# Altium project HIVE_SIGHT.PrjPcb (part 2 of 4)

## Sheet HIVE_SIGHT_DECAWAVE_A.SchDoc
size Tabloid; SheetNumber: 4; SheetTotal: 6; Sheet_Name: DECAWAVE; Size: 11x17
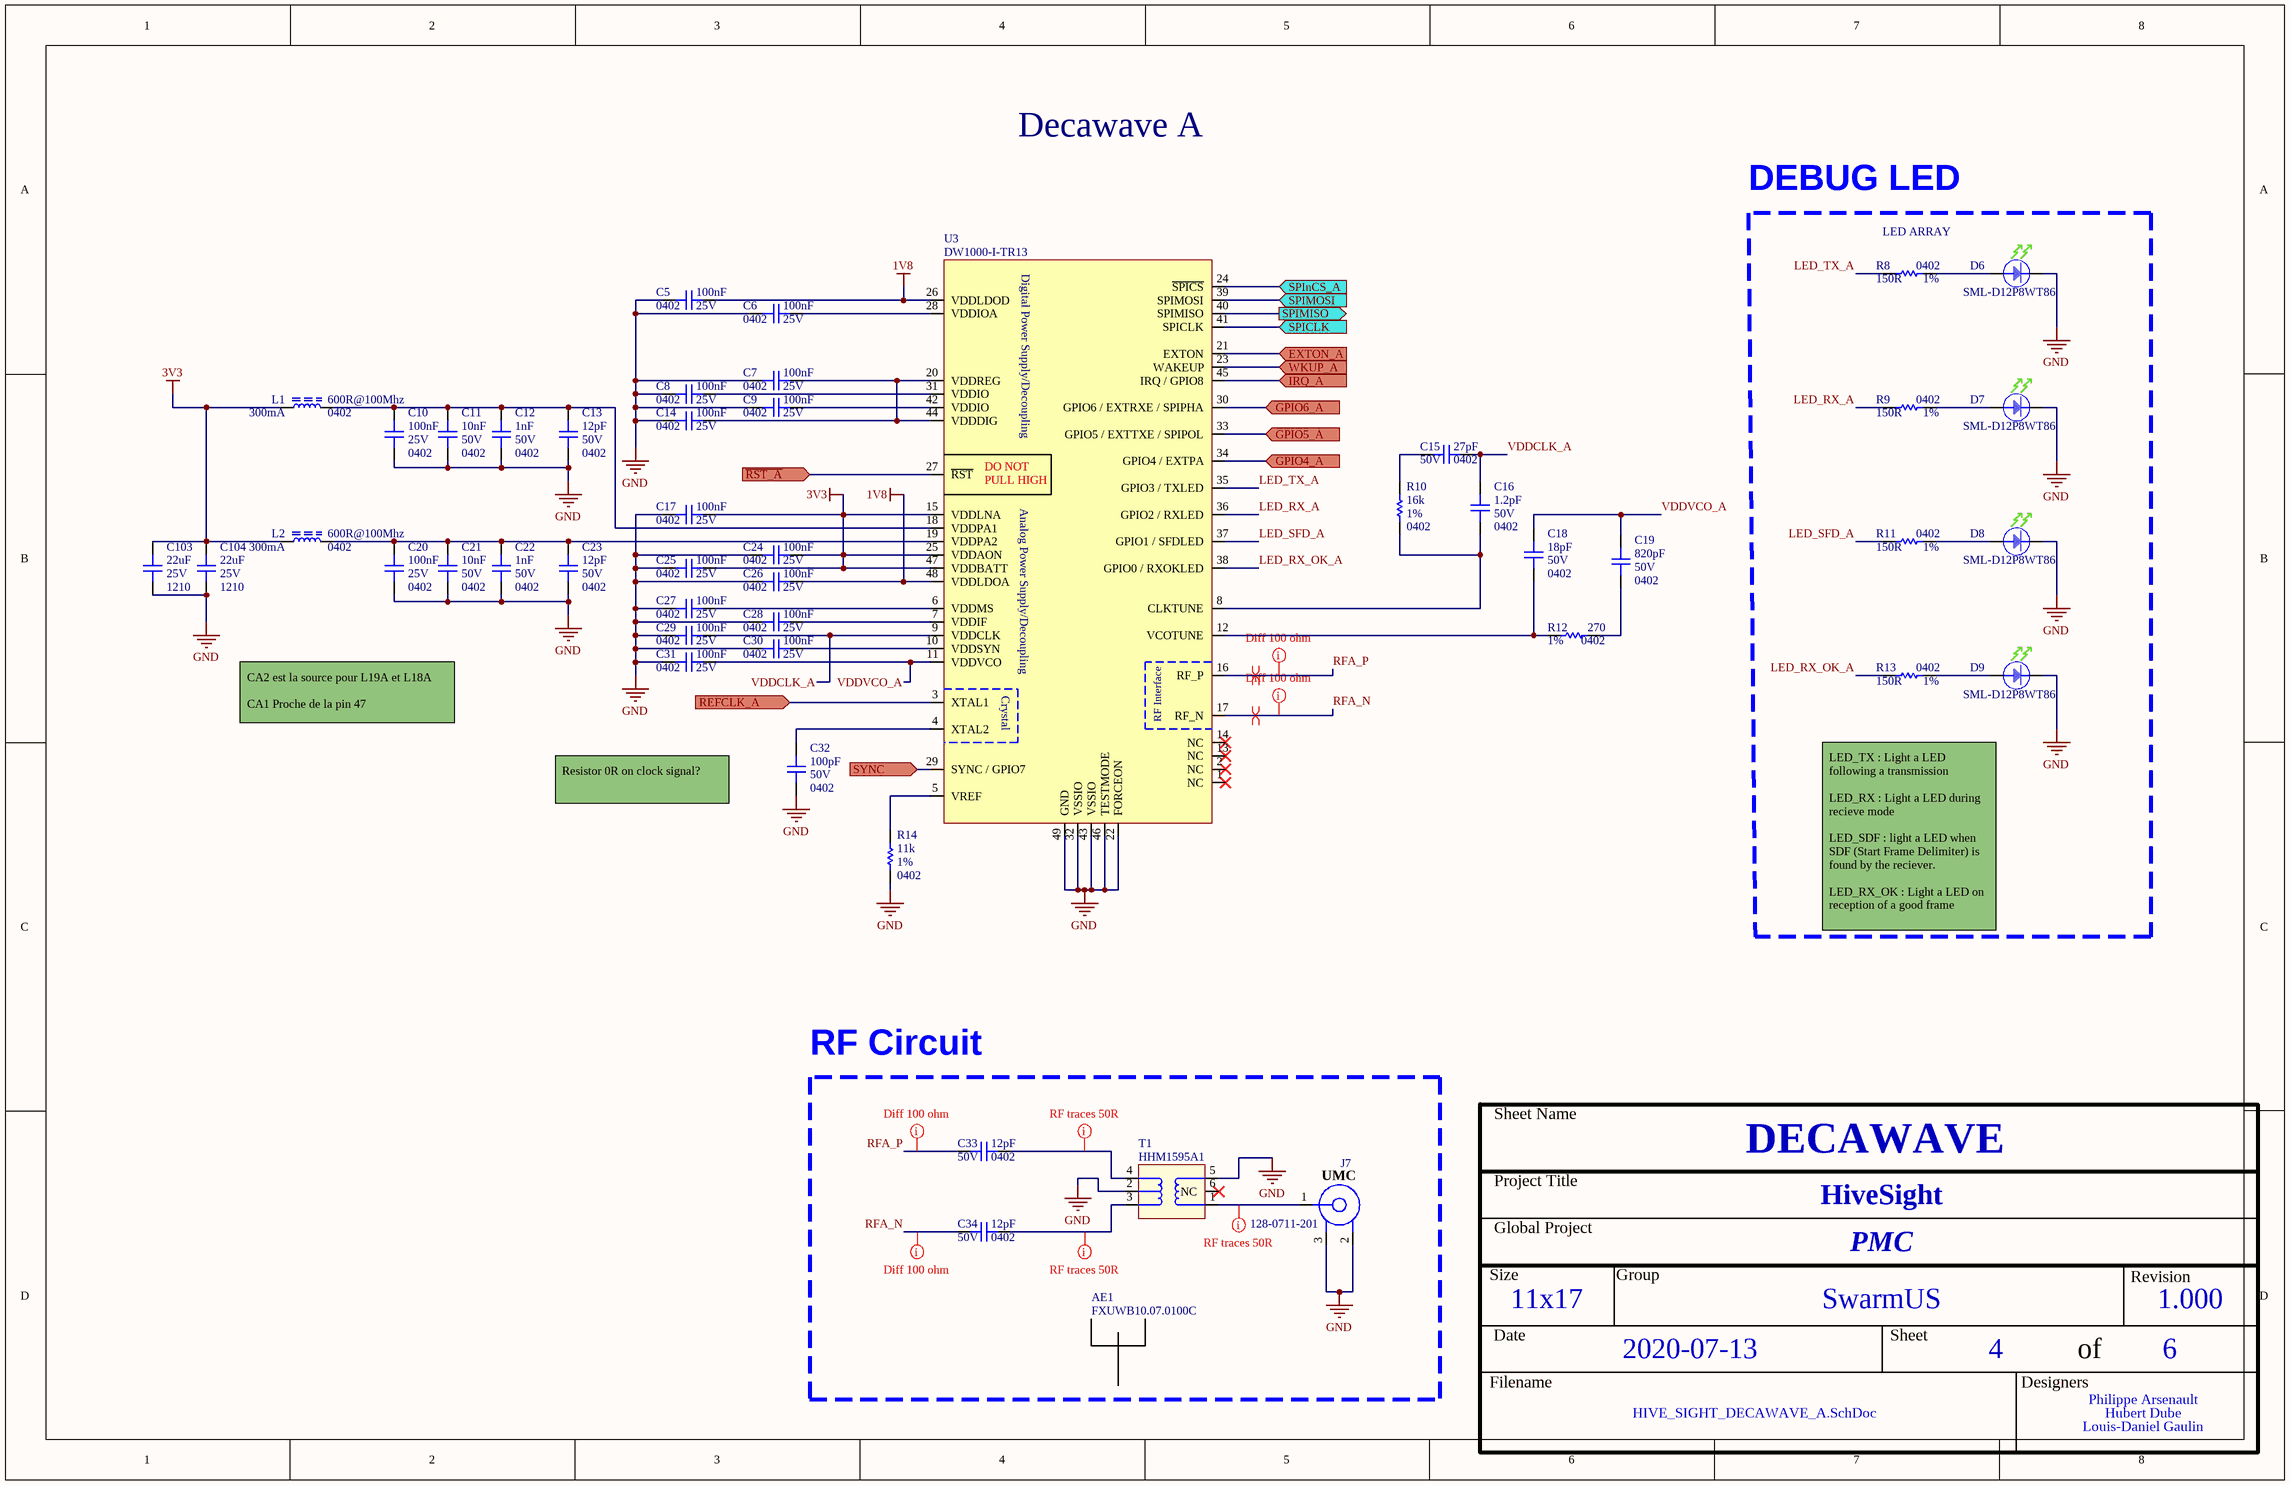
[diagram p4: HIVE_SIGHT_DECAWAVE_A.SchDoc]

### Parts
AE1  FXUWB10.07.0100C  (mechanical)
C5  value 100nF  Package: 0402  Voltage Rating: 25V  [CAP_CER_0402]  (hidden comment: CGA2B3X7R1E104K050BB)
C6  value 100nF  Package: 0402  Voltage Rating: 25V  [CAP_CER_0402]  (hidden comment: CGA2B3X7R1E104K050BB)
C7  value 100nF  Package: 0402  Voltage Rating: 25V  [CAP_CER_0402]  (hidden comment: CGA2B3X7R1E104K050BB)
C8  value 100nF  Package: 0402  Voltage Rating: 25V  [CAP_CER_0402]  (hidden comment: CGA2B3X7R1E104K050BB)
C9  value 100nF  Package: 0402  Voltage Rating: 25V  [CAP_CER_0402]  (hidden comment: CGA2B3X7R1E104K050BB)
C10  value 100nF  Package: 0402  Voltage Rating: 25V  [CAP_CER_0402]  (hidden comment: CGA2B3X7R1E104K050BB)
C11  value 10nF  Package: 0402  Voltage Rating: 50V  [CAP_CER_0402]  (hidden comment: CL05B103KB5NFNC)
C12  value 1nF  Package: 0402  Voltage Rating: 50V  [CAP_CER_0402]  (hidden comment: CC0402KRX7R9BB102)
C13  value 12pF  Package: 0402  Voltage Rating: 50V  [CAP_CER_0402]  (hidden comment: CC0402JRNPO9BN120)
C14  value 100nF  Package: 0402  Voltage Rating: 25V  [CAP_CER_0402]  (hidden comment: CGA2B3X7R1E104K050BB)
C15  value 27pF  Package: 0402  Voltage Rating: 50V  [CAP_CER_0402]  (hidden comment: CC0402JRNPO9BN270)
C16  value 1.2pF  Package: 0402  Voltage Rating: 50V  [CAP_CER_0402]  (hidden comment: C0402C129C5GACTU)
C17  value 100nF  Package: 0402  Voltage Rating: 25V  [CAP_CER_0402]  (hidden comment: CGA2B3X7R1E104K050BB)
C18  value 18pF  Package: 0402  Voltage Rating: 50V  [CAP_CER_0402]  (hidden comment: GRM1555C1H180GA01D)
C19  value 820pF  Package: 0402  Voltage Rating: 50V  [CAP_CER_0402]  (hidden comment: CC0402KRX7R9BB821)
C20  value 100nF  Package: 0402  Voltage Rating: 25V  [CAP_CER_0402]  (hidden comment: CGA2B3X7R1E104K050BB)
C21  value 10nF  Package: 0402  Voltage Rating: 50V  [CAP_CER_0402]  (hidden comment: CL05B103KB5NFNC)
C22  value 1nF  Package: 0402  Voltage Rating: 50V  [CAP_CER_0402]  (hidden comment: CC0402KRX7R9BB102)
C23  value 12pF  Package: 0402  Voltage Rating: 50V  [CAP_CER_0402]  (hidden comment: CC0402JRNPO9BN120)
C24  value 100nF  Package: 0402  Voltage Rating: 25V  [CAP_CER_0402]  (hidden comment: CGA2B3X7R1E104K050BB)
C25  value 100nF  Package: 0402  Voltage Rating: 25V  [CAP_CER_0402]  (hidden comment: CGA2B3X7R1E104K050BB)
C26  value 100nF  Package: 0402  Voltage Rating: 25V  [CAP_CER_0402]  (hidden comment: CGA2B3X7R1E104K050BB)
C27  value 100nF  Package: 0402  Voltage Rating: 25V  [CAP_CER_0402]  (hidden comment: CGA2B3X7R1E104K050BB)
C28  value 100nF  Package: 0402  Voltage Rating: 25V  [CAP_CER_0402]  (hidden comment: CGA2B3X7R1E104K050BB)
C29  value 100nF  Package: 0402  Voltage Rating: 25V  [CAP_CER_0402]  (hidden comment: CGA2B3X7R1E104K050BB)
C30  value 100nF  Package: 0402  Voltage Rating: 25V  [CAP_CER_0402]  (hidden comment: CGA2B3X7R1E104K050BB)
C31  value 100nF  Package: 0402  Voltage Rating: 25V  [CAP_CER_0402]  (hidden comment: CGA2B3X7R1E104K050BB)
C32  value 100pF  Package: 0402  Voltage Rating: 50V  [CAP_CER_0402]  (hidden comment: CC0402JRNPO9BN101)
C33  value 12pF  Package: 0402  Voltage Rating: 50V  [CAP_CER_0402]  (hidden comment: CC0402JRNPO9BN120)
C34  value 12pF  Package: 0402  Voltage Rating: 50V  [CAP_CER_0402]  (hidden comment: CC0402JRNPO9BN120)
C103  value 22uF  Package: 1210  Voltage Rating: 25V  [CAP_CER_1210]  (hidden comment: C3225X7R1E226M250AB)
C104  value 22uF  Package: 1210  Voltage Rating: 25V  [CAP_CER_1210]  (hidden comment: C3225X7R1E226M250AB)
D6  SML-D12P8WT86  [LED_SML-D12P8WT86]
D7  SML-D12P8WT86  [LED_SML-D12P8WT86]
D8  SML-D12P8WT86  [LED_SML-D12P8WT86]
D9  SML-D12P8WT86  [LED_SML-D12P8WT86]
J7  128-0711-201  [CON_UMC_128-0711-201]
L1  value 600R@100Mhz  Current Rating: 300mA  Package: 0402  [FER_0603]  (hidden comment: BLM15AG601SN1D)
L2  value 600R@100Mhz  Current Rating: 300mA  Package: 0402  [FER_0603]  (hidden comment: BLM15AG601SN1D)
R8  value 150R  Tolerance: 1%  Package: 0402  [RES_0402]  (hidden comment: RC0402FR-07150RL)
R9  value 150R  Tolerance: 1%  Package: 0402  [RES_0402]  (hidden comment: RC0402FR-07150RL)
R10  value 16k  Tolerance: 1%  Package: 0402  [RES_0402]  (hidden comment: RC0402FR-0716KL)
R11  value 150R  Tolerance: 1%  Package: 0402  [RES_0402]  (hidden comment: RC0402FR-07150RL)
R12  value 270  Tolerance: 1%  Package: 0402  [FER_0402]  (hidden comment: RC0402FR-07270RL)
R13  value 150R  Tolerance: 1%  Package: 0402  [RES_0402]  (hidden comment: RC0402FR-07150RL)
R14  value 11k  Tolerance: 1%  Package: 0402  [RES_0402]  (hidden comment: RC0402FR-0711KL)
T1  HHM1595A1  [XFR_HHM1595A1]
U3  DW1000-I-TR13  [COM_XCV_DW1000-I-TR13]

### Blocks framed on the sheet
DEBUG LED: D6-D9 R8 R9 R11 R13
RF Circuit: AE1 C33 C34 J7 T1

### Ports
EXTON_A (in), GPIO4_A (in), GPIO5_A (in), GPIO6_A (in), IRQ_A (in), REFCLK_A (in), SPICLK (in), SPIMISO (out), SPIMOSI (in), SPInCS_A (in), SYNC (in), WKUP_A (in), ~{RST_A} (in)

### Nets
1V8: C5.1 C26.1 U3.26(VDDLDOD) U3.48(VDDLDOA)
3V3: C17.1 C24.1 C25.1 C103.2 C104.2 L1.1 L2.1 U3.15(VDDLNA) U3.25(VDDAON) U3.47(VDDBATT)
GND: C5.2 C6.2 C7.2 C8.2 C9.2 C10.1 C11.1 C12.1 C13.1 C14.2 C17.2 C20.1 C21.1 C22.1 C23.1 C24.2 C25.2 C26.2 C27.2 C28.2 C29.2 C30.2 C31.2 C32.1 C103.1 C104.1 D6.K D7.K D8.K D9.K J7.2 J7.3 R14.1 T1.2(GND) T1.5 U3.22(FORCEON) U3.32(VSSIO) U3.43(VSSIO) U3.46(TESTMODE) U3.49(GND)
LED_RX_A: R9.2 U3.36(GPIO2_/_RXLED)
LED_RX_OK_A: R13.2 U3.38(GPIO0_/_RXOKLED)
LED_SFD_A: R11.2 U3.37(GPIO1_/_SFDLED)
LED_TX_A: R8.2 U3.35(GPIO3_/_TXLED)
RFA_N: C34.2 U3.17(RF_N)
RFA_P: C33.2 U3.16(RF_P)
RST_A#: U3.27(~{RST}) ; port ~{RST_A}
VDDCLK_A: C15.1 C16.2 C29.1 U3.9(VDDCLK)
VDDVCO_A: C18.2 C19.2 C31.1 U3.11(VDDVCO)
NetC6_1: C6.1 U3.28(VDDIOA)
NetC7_1: C7.1 C14.1 U3.20(VDDREG) U3.44(VDDDIG)
NetC8_1: C8.1 U3.31(VDDIO)
NetC9_1: C9.1 U3.42(VDDIO)
NetC10_2: C10.2 C11.2 C12.2 C13.2 L1.2 U3.18(VDDPA1)
NetC15_2: C15.2 R10.2
NetC16_1: C16.1 R10.1 U3.8(CLKTUNE)
NetC18_1: C18.1 R12.2 U3.12(VCOTUNE)
NetC19_1: C19.1 R12.1
NetC20_2: C20.2 C21.2 C22.2 C23.2 L2.2 U3.19(VDDPA2)
NetC27_1: C27.1 U3.6(VDDMS)
NetC28_1: C28.1 U3.7(VDDIF)
NetC30_1: C30.1 U3.10(VDDSYN)
NetC32_2: C32.2 U3.4(XTAL2)
NetC33_1: C33.1 T1.4
NetC34_1: C34.1 T1.3
NetC65_1: U3.3(XTAL1) ; port REFCLK_A
NetD6_A: D6.A R8.1
NetD7_A: D7.A R9.1
NetD8_A: D8.A R11.1
NetD9_A: D9.A R13.1
NetJ7_1: J7.1 T1.1
NetR14_2: R14.2 U3.5(VREF)
NetU3_21: U3.21(EXTON) ; port EXTON_A
NetU3_23: U3.23(WAKEUP) ; port WKUP_A
NetU3_24: U3.24(~{SPICS}) ; port SPInCS_A
NetU3_29: U3.29(SYNC_/_GPIO7) ; port SYNC
NetU3_30: U3.30(GPIO6_/_EXTRXE_/_SPIPHA) ; port GPIO6_A
NetU3_33: U3.33(GPIO5_/_EXTTXE_/_SPIPOL) ; port GPIO5_A
NetU3_34: U3.34(GPIO4_/_EXTPA) ; port GPIO4_A
NetU3_39: U3.39(SPIMOSI) ; port SPIMOSI
NetU3_40: U3.40(SPIMISO) ; port SPIMISO
NetU3_41: U3.41(SPICLK) ; port SPICLK
NetU3_45: U3.45(IRQ_/_GPIO8) ; port IRQ_A

Not connected (* = marked no-connect by the designer): T1 6(NC)*; U3 1(NC)* 2(NC)* 13(NC)* 14(NC)*

### Layout directives
mark named RF traces 50R: NetC33_1, NetC34_1, NetJ7_1
mark named Diff 100 ohm: RFA_N, RFA_P
differential pair: RFA_N, RFA_P

### Notes on the sheet
- Decawave A
- (near R8) LED ARRAY
- CA2 est la source pour L19A et L18A
  CA1 Proche de la pin 47
- Resistor 0R on clock signal?
- LED_TX : Light a LED following a transmission
  LED_RX : Light a LED during recieve mode
  LED_SDF : light a LED when SDF (Start Frame Delimiter) is found by the reciever.
  LED_RX_OK : Light a LED on reception of a good frame
- Sheet Name
- Project Title
- Global Project
- Size
- Group
- Revision
- Date
- Sheet
- of
- Filename
- Designers
- (in symbol COM_XCV_DW1000-I-TR13) Digital Power Supply/Decoupling; DO NOT; PULL HIGH; Analog Power Supply/Decoupling; Crystal; RF Interface
- (in symbol CON_UMC_128-0711-201) UMC

### Library data of the parts
AE1 = ANT_FXUWB10.07.0100C: External antenna - UWB - UMCC plug; Value: 3.0-10.3GHz; GRAMS Lib Spec: 2.8; HelpURL: http://cdn.taoglas.com/datasheets/FXUWB10.07.0100C.pdf; CreatedBy/Date: Philippe Arsenault; Temperature: -40°C to 85°C; Package: 50 ohm; Assembly Type: UMCC plug; Part Number #1: FXUWB10.07.0100C; Supplier 1: Digi-Key; Supplier Part Number 1: 931-1523-ND
C5-C10 C14 C17 C20 C24-C31 = CAP_CER_CGA2B3X7R1E104K050BB: CAP - CER 0.1µF 10% 25V X7R - 0402; Manufacturer #1: TDK Corporation; GRAMS Lib Spec: 2.8; Magnetic Material: Unknown; Polarized: NO; Assembly Type: SMD; CreatedBy/Date: Nicolas Roy 2018-11-07; Current Rating: *; HelpURL: https://product.tdk.com/info/en/catalog/datasheets/mlcc_automotive_general_en.pdf; Manufacturer #2: *; Note: *; Part Number #1: CGA2B3X7R1E104K050BB; Part Number #2: *; Power Max: *; Temperature: -55°C ~ 125°C; Tolerance: 10%; VerifiedBy: Nicolas V. (2019-01-22); Supplier 1: Digi-Key; Supplier Part Number 1: 445-6902-1-ND; Cryo: UNKNOWN
C11 C21 = CAP_CER_CL05B103KB5NFNC: CAP - CER 10nF ±10% 50V X7R - 0402; Manufacturer #1: Samsung Electro-Mechanics; GRAMS Lib Spec: 2.8; Magnetic Material: Unknown; Polarized: No; Assembly Type: SMD; CreatedBy/Date: Keven Deslandes - 2018/11/20; Current Rating: *; HelpURL: http://www.samsungsem.com/kr/support/product-search/mlcc/CL05B103KB5NFNC.jsp; Manufacturer #2: *; Note: *; Part Number #1: CL05B103KB5NFNC; Part Number #2: *; Power Max: *; Temperature: -55°C ~ 125°C; Tolerance: 10%; VerifiedBy: Nicolas Roy - 2018/12/11; Supplier 1: Digi-Key; Supplier Part Number 1: 1276-1499-1-ND; Cryo: UNKNOWN
C12 C22 = CAP_CER_CC0402KRX7R9BB102: CAP - CER 1nF 10% 50V X7R - 0402; Manufacturer #1: Yageo; GRAMS Lib Spec: 2.8; Magnetic Material: UNKNOWN; Polarized: NO; Assembly Type: SMD; CreatedBy/Date: Jonathan Bouchard 2019-04-06; Current Rating: *; HelpURL: http://www.yageo.com/documents/recent/UPY-GPHC_X7R_6.3V-to-50V_18.pdf; Manufacturer #2: *; Note: *; Part Number #1: CC0402KRX7R9BB102; Part Number #2: *; Power Max: *; Temperature: -55°C ~ 125°C; Tolerance: 10%; VerifiedBy: Nicolas V. (2019-04-30); Supplier 1: Digi-Key; Supplier Part Number 1: 311-1036-1-ND; Cryo: UNKNOWN
C13 C23 C33 C34 = CAP_CER_CC0402JRNPO9BN120: CAP - CER 12pF 50V ±5% C0G, NP0 - 0402; Manufacturer #1: Yageo; GRAMS Lib Spec: 2.8; Magnetic Material: Unknown; Polarized: NO; Assembly Type: SMD; CreatedBy/Date: Philippe Arsenault/ 2020-07-24; Current Rating: *; HelpURL: https://www.yageo.com/upload/media/product/productsearch/datasheet/mlcc/UPY-GP_NP0_16V-to-50V_18.pdf; Manufacturer #2: *; Note: *; Part Number #1: CC0402JRNPO9BN120; Part Number #2: *; Power Max: *; Temperature: -55°C ~ 125°C; Tolerance: ±5%; VerifiedBy: Louis-Daniel Gaulin / 2020-07-29; Cryo: UNKNOWN; Supplier 1: Digi-Key; Supplier Part Number 1: 311-1016-1-ND
C15 = CAP_CER_CC0402JRNPO9BN270: CAP - CER 27pF 50V ±5% C0G, NP0 - 0402; Manufacturer #1: Yageo; GRAMS Lib Spec: 2.8; Magnetic Material: Unknown; Polarized: NO; Assembly Type: SMD; CreatedBy/Date: Philippe Arsenault/ 2020-07-24; Current Rating: *; HelpURL: https://www.yageo.com/upload/media/product/productsearch/datasheet/mlcc/UPY-GP_NP0_16V-to-50V_18.pdf; Manufacturer #2: *; Note: *; Part Number #1: CC0402JRNPO9BN270; Part Number #2: *; Power Max: *; Temperature: -55°C ~ 125°C; Tolerance: ±5%; VerifiedBy: Louis-Daniel Gaulin / 2020-07-29; Cryo: UNKNOWN; Supplier 1: Digi-Key; Supplier Part Number 1: 311-1019-1-ND
C16 = CAP_CER_C0402C129C5GACTU: CAP - CER 1.2pF 50V ±0.25pF C0G, NP0 - 0402; Manufacturer #1: KEMET; GRAMS Lib Spec: 2.8; Magnetic Material: Unknown; Polarized: NO; Assembly Type: SMD; CreatedBy/Date: Philippe Arsenault/ 2020-07-24; Current Rating: *; HelpURL: https://content.kemet.com/datasheets/KEM_C1003_C0G_SMD.pdf; Manufacturer #2: *; Note: *; Part Number #1: C0402C129C5GACTU; Part Number #2: *; Power Max: *; Temperature: -55°C ~ 125°C; Tolerance: ±0.25pF; VerifiedBy: Louis-Daniel Gaulin / 2020-07-29; Cryo: UNKNOWN; Supplier 1: Digi-Key; Supplier Part Number 1: 399-1001-1-ND
C18 = CAP_CER_GRM1555C1H180GA01D: CAP - CER 18pF 50V C0G, NPO - 0402; Manufacturer #1: Murata Electronics North America; Tolerance: 2%; GRAMS Lib Spec: 2.8; Note: Not for new Design; Magnetic Material: UNKNOWN; Polarized: NO; Current Rating: *; Power Max: *; HelpURL: https://psearch.en.murata.com/capacitor/product/GRM1555C1H180GA01%23.html; CreatedBy/Date: Tommy Rossignol / 2018-11-20; VerifiedBy: Caroline Paulin - 13 fév 2019; Temperature: -55°C ~ 125°C; Manufacturer #2: *; Assembly Type: SMD; Part Number #2: *; Part Number #1: GRM1555C1H180GA01D; Supplier 1: Digi-Key; Supplier Part Number 1: 490-6204-1-ND; Cryo: UNKNOWN
C19 = CAP_CER_CC0402KRX7R9BB821: CAP - CER 820pF 50V ±10% X7R - 0402; Manufacturer #1: Yageo; GRAMS Lib Spec: 2.8; Magnetic Material: Unknown; Polarized: NO; Assembly Type: SMD; CreatedBy/Date: Philippe Arsenault/ 2020-07-24; Current Rating: *; HelpURL: https://www.yageo.com/upload/media/product/productsearch/datasheet/mlcc/UPY-GPHC_X7R_6.3V-to-50V_18.pdf; Manufacturer #2: *; Note: *; Part Number #1: CC0402KRX7R9BB821; Part Number #2: *; Power Max: *; Temperature: -55°C ~ 125°C; Tolerance: ±10%; VerifiedBy: Louis-Daniel Gaulin / 2020-07-29; Cryo: UNKNOWN; Supplier 1: Digi-Key; Supplier Part Number 1: 311-1727-1-ND
C32 = CAP_CER_CC0402JRNPO9BN101: CAP - CER 100pF 50V ±5% C0G,CP0 - 0402; Manufacturer #1: Yageo; GRAMS Lib Spec: 2.8; Magnetic Material: Unknown; Polarized: NO; Assembly Type: SMD; CreatedBy/Date: Philippe Arsenault/ 2020-07-24; Current Rating: *; HelpURL: https://www.yageo.com/upload/media/product/productsearch/datasheet/mlcc/UPY-GPHC_X7R_6.3V-to-50V_18.pdf; Manufacturer #2: *; Note: *; Part Number #1: CC0402JRNPO9BN101; Part Number #2: *; Power Max: *; Temperature: -55°C ~ 125°C; Tolerance: ±5%; VerifiedBy: Louis-Daniel Gaulin / 2020-07-29; Cryo: UNKNOWN; Supplier 1: Digi-Key; Supplier Part Number 1: 311-1024-1-ND
C103 C104 = CAP_CER_C3225X7R1E226M250AB: CAP - CER 22UF 20% 25V X7R - 1210; Manufacturer #1: TDK Corporation; GRAMS Lib Spec: 2.8; Magnetic Material: Unknown; Polarized: No; Tolerance: 20%; Current Rating: *; Power Max: *; HelpURL: https://product.tdk.com/info/en/documents/chara_sheet/C3225X7R1E226M250AB.pdf; CreatedBy/Date: Nicolas V. (2019-12-11); VerifiedBy: Nicolas V. (2019-12-11); Temperature: -55°C ~ 125°C; Manufacturer #2: *; Note: *; Assembly Type: SMD; Part Number #2: *; Part Number #1: C3225X7R1E226M250AB; Supplier 1: Digi-Key; Supplier Part Number 1: 445-181602-1-ND; Cryo: UNKNOWN
D6-D9 = LED_SML-D12P8WT86: LED - GREEN DIFFUSED 0603 SMD - 0603; Manufacturer #1: Rohm Semiconductor; Current Rating: 1-20mA; Note: Operate at 2mA; Value: 560 nm (green); Voltage rating: 2.2V (Forward), 5V (max Reverse); Polarized: Yes; Magnetic Material: Unknown; GRAMS Lib Spec: 2.8; Manufacturer #2: *; Power Max: *; Part Number #1: SML-D12P8WT86; Part Number #2: *; HelpURL: https://d1d2qsbl8m0m72.cloudfront.net/en/products/databook/datasheet/opto/led/chip_mono/sml-d12x8_d13x8-e.pdf; Supplier 1: Digi-Key; Supplier Part Number 1: 511-1579-2-ND; Assembly Type: SMD; Temperature: -40 ~ 85 °C; Package: 0603; CreatedBy/Date: Keven Deslandes - 2018/11/21; Tolerance: *; VerifiedBy: Caroline Paulin - 13 février 2019; Cryo: UNKNOWN
J7 = CON_UMC_128-0711-201: CON - UMC JACK STR 50 OHM - SMD; Manufacturer #1: Cinch Connectivity Solutions Johnson; Note: Straight; Value: 50 Ohm, 6 GHz; Voltage rating: 200V; Polarized: No; GRAMS Lib Spec: 2.8; Cryo: UNKNOWN; Current Rating: *; Manufacturer #2: *; Power Max: *; Part Number #1: 128-0711-201; Part Number #2: *; HelpURL: https://belfuse.com/resources/cinch-brochures/CCS%20Johnson%20UMC%20Ultra%20Miniature%20Connectors.pdf; Supplier 1: Digi-Key; Supplier Part Number 1: J983CT-ND; Assembly Type: SMD; Magnetic Material: *; Temperature: -40°C ~ 90°C; Package: SMD; CreatedBy/Date: Keven Desandes - 2018/09/27; Tolerance: *; VerifiedBy: Caroline Paulin - 23 janv 2019
L1 L2 = FER_BLM15AG601SN1D: FER - FERRITE BEAD 600 OHM@100MHz - 0402; Manufacturer #1: Murata; GRAMS Lib Spec: 2.8; Magnetic Material: YES; Polarized: NO; Cryo: UNKNOWN; Tolerance: *; Voltage Rating: *; Power Max: *; HelpURL: https://www.murata.com/en-us/products/productdata/8796740059166/ENFA0018.pdf; CreatedBy/Date: Philippe Arsenault/2020-07-24; Temperature: -55°C ~ 125°C; Manufacturer #2: *; Note: *; Assembly Type: SMD; Part Number #2: *; Part Number #1: BLM15AG601SN1D; Supplier 1: Digi-Key; Supplier Part Number 1: 490-1006-1-ND
R8 R9 R11 R13 = RES_RC0402FR-07150RL: RES - 150R 1% 1/16W - 0402; Manufacturer #1: Yageo; GRAMS Lib Spec: 2.8; Magnetic Material: Unknown; Polarized: No; Voltage Rating: 50V; Assembly Type: SMD; CreatedBy/Date: Jonathan Bouchard 2019-03-25; Current Rating: *; HelpURL: http://www.yageo.com/documents/recent/PYu-RC_Group_51_RoHS_L_10.pdf; Manufacturer #2: *; Part Number #1: RC0402FR-07150RL; Part Number #2: *; Power Max: 1/16W; Temperature: -55°C ~ 155°C; VerifiedBy: Nicolas V. (2019-05-02); Supplier 1: Digi-Key; Supplier Part Number 1: 311-150LRCT-ND; Cryo: UNKNOWN
R10 = RES_RC0402FR-0716KL: RES - 16k OHM 1% 1/16W - 0402; Manufacturer #1: Yageo; GRAMS Lib Spec: 2.8; Magnetic Material: Unknown; Polarized: NO; Voltage Rating: 50V; Assembly Type: SMD; CreatedBy/Date: Nicolas Roy/18 oct. 2018; Current Rating: *; HelpURL: http://www.yageo.com/documents/recent/PYu-RC_Group_51_RoHS_L_9.pdf; Manufacturer #2: *; Part Number #1: RC0402FR-0716KL; Part Number #2: *; Power Max: 1/16W; Temperature: -55°C ~ 155°C; VerifiedBy: Caroline Paulin - 18/12/2018; Supplier 1: Digi-Key; Supplier Part Number 1: 311-16.0KLRCT-ND; Cryo: UNKNOWN
R12 = RES_RC0402FR-07270RL: RES - 270R 1% 1/16W - 0402; Manufacturer #1: Yageo; GRAMS Lib Spec: 2.8c; Magnetic Material: Unknown; Polarized: No; Voltage Rating: 50V; Assembly Type: SMD; CreatedBy/Date: Philippe Arsenault 2020-07-24; Current Rating: *; HelpURL: https://www.yageo.com/upload/media/product/productsearch/datasheet/rchip/PYu-RC_Group_51_RoHS_L_10.pdf; Manufacturer #2: *; Note: *; Part Number #1: RC0402FR-07270RL; Part Number #2: *; Power Max: 1/16W; Temperature: -55°C ~ 155°C; VerifiedBy: Louis-Daniel Gaulin / 03-10-2020; Supplier 1: Digi-Key; Supplier Part Number 1: 311-270LRCT-ND
R14 = RES_RC0402FR-0711KL: RES - 11K 1% 1/16W - 0402; Manufacturer #1: Yageo; GRAMS Lib Spec: 2.8; Magnetic Material: Unknown; Polarized: No; Voltage Rating: 50V; Assembly Type: SMD; CreatedBy/Date: Keven Deslandes 2018-10-15; Current Rating: *; HelpURL: http://www.yageo.com/documents/recent/PYu-RC_Group_51_RoHS_L_9.pdf; Manufacturer #2: *; Part Number #1: RC0402FR-0711KL; Part Number #2: *; Power Max: 1/16W; Temperature: -55°C ~ 155°C; VerifiedBy: Carolilne Paulin - 18/12/2018; Supplier 1: Digi-Key; Supplier Part Number 1: 311-11.0KLRCT-ND; Cryo: UNKNOWN
T1 = XFR_HHM1595A1: XFR - Imp Unbalaced/Balanced 50/100 3-8GHz  -SMD; Manufacturer #1: TDK; Value: 3GHz  ~ 8GHz; GRAMS Lib Spec: 2.8; Magnetic Material: Unknown; Polarized: Yes; Tolerance: *; Voltage Rating: *; Current Rating: *; Power Max: *; HelpURL: https://product.tdk.com/info/en/documents/data_sheet/rf_balun_hhm1595a1_en.pdf; CreatedBy/Date: Philippe Arsenault/2020-21-07; VerifiedBy: Louis-Daniel Gaulin / 03-10-2020; Temperature: -40°C ~ 85°C; Package: 0805; Manufacturer #2: *; Note: *; Assembly Type: MT; Part Number #2: *; Part Number #1: HHM1595A1; Supplier 1: Digi-Key; Supplier Part Number 1: 445-3387-1-ND
U3 = COM_XCV_DW1000-I-TR13: COM - IC RF TxRx 802.15.4 IR-UWB DECAWAVE - 48-VFQFN EP; Voltage Rating: 2.8 - 3.6 V; Current Rating: Rx 64mA/Tx 31mA; GRAMS Lib Spec: 2.8; Magnetic Material: Unknown; Polarized: Yes; Cryo: No; Value: *; Tolerance: *; Power Max: *; HelpURL: https://www.decawave.com/sites/default/files/resources/DW1000-Datasheet-V2.12.pdf; CreatedBy/Date: Philippe Arsenault/13-07-2020; Temperature: -40°C ~ 85°C; Package: QFN 48; Manufacturer #1: Decawave; Manufacturer #2: Qorvo; Note: *; Assembly Type: SMT; Part Number #2: *; Part Number #1: DW1000-I-TR13; Supplier 1: Digi-Key; Supplier Part Number 1: 1479-1001-1-ND

## Sheet HIVE_SIGHT_WIRELESS.SchDoc
size Tabloid; SheetNumber: 5; SheetTotal: 6; Sheet_Name: WIRELESS; Size: 11x17
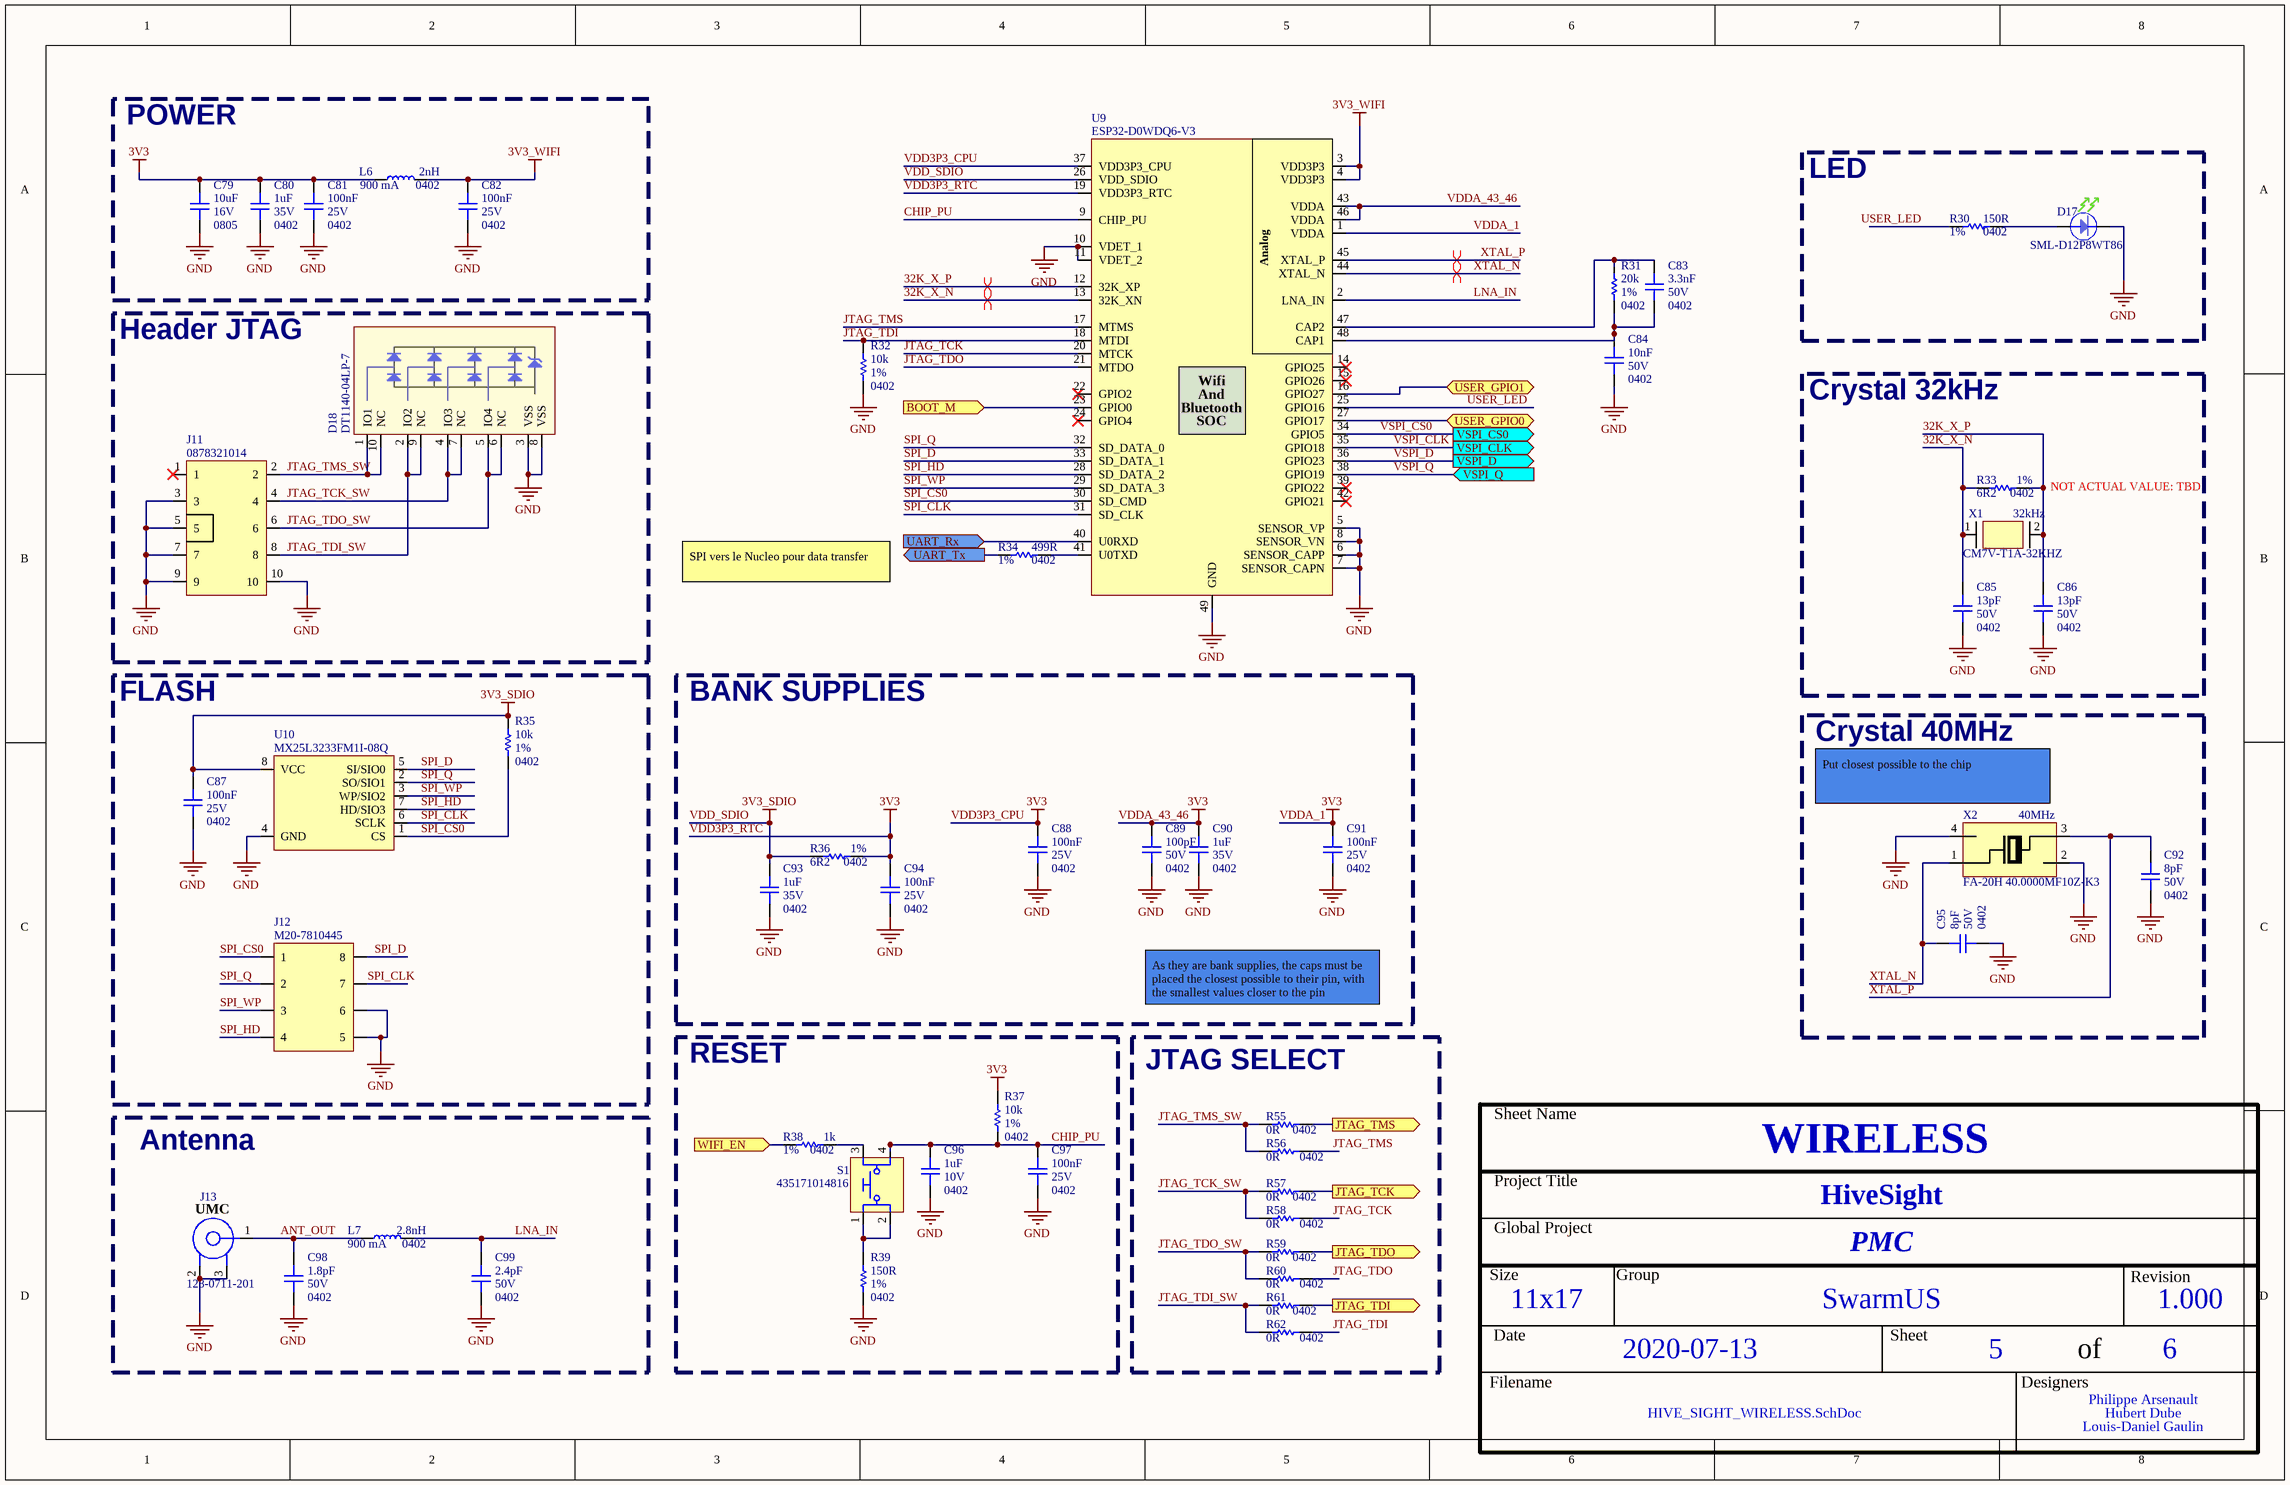
[diagram p5: HIVE_SIGHT_WIRELESS.SchDoc]

### Parts
C79  value 10uF  Package: 0805  Voltage Rating: 16V  [CAP_CER_0805]  (hidden comment: 0805YD106KAT2A)
C80  value 1uF  Package: 0402  Voltage Rating: 35V  [CAP_CER_0402]  (hidden comment: CL05A105KL5NRNC)
C81  value 100nF  Package: 0402  Voltage Rating: 25V  [CAP_CER_0402]  (hidden comment: CL05A104KA5NNNC)
C82  value 100nF  Package: 0402  Voltage Rating: 25V  [CAP_CER_0402]  (hidden comment: CL05A104KA5NNNC)
C83  value 3.3nF  Package: 0402  Voltage Rating: 50V  [CAP_CER_0402]  (hidden comment: C0402C332K5RACAUTO)
C84  value 10nF  Package: 0402  Voltage Rating: 50V  [CAP_CER_0402]  (hidden comment: GRM155R71H103KA88D)
C85  value 13pF  Package: 0402  Voltage Rating: 50V  [CAP_CER_0402]  (hidden comment: CC0402JRNPO9BN130)
C86  value 13pF  Package: 0402  Voltage Rating: 50V  [CAP_CER_0402]  (hidden comment: CC0402JRNPO9BN130)
C87  value 100nF  Package: 0402  Voltage Rating: 25V  [CAP_CER_0402]  (hidden comment: CL05A104KA5NNNC)
C88  value 100nF  Package: 0402  Voltage Rating: 25V  [CAP_CER_0402]  (hidden comment: CL05A104KA5NNNC)
C89  value 100pF  Package: 0402  Voltage Rating: 50V  [CAP_CER_0402]  (hidden comment: CC0402JRNPO9BN101)
C90  value 1uF  Package: 0402  Voltage Rating: 35V  [CAP_CER_0402]  (hidden comment: CL05A105KL5NRNC)
C91  value 100nF  Package: 0402  Voltage Rating: 25V  [CAP_CER_0402]  (hidden comment: CL05A104KA5NNNC)
C92  value 8pF  Package: 0402  Voltage Rating: 50V  [CAP_CER_0402]  (hidden comment: CC0402DRNPO9BN8R0)
C93  value 1uF  Package: 0402  Voltage Rating: 35V  [CAP_CER_0402]  (hidden comment: CL05A105KL5NRNC)
C94  value 100nF  Package: 0402  Voltage Rating: 25V  [CAP_CER_0402]  (hidden comment: CL05A104KA5NNNC)
C95  value 8pF  Package: 0402  Voltage Rating: 50V  [CAP_CER_0402]  (hidden comment: CC0402DRNPO9BN8R0)
C96  value 1uF  Package: 0402  Voltage Rating: 10V  [CAP_CER_0402]  (hidden comment: CL05A105MP5NNNC)
C97  value 100nF  Package: 0402  Voltage Rating: 25V  [CAP_CER_0402]  (hidden comment: CL05A104KA5NNNC)
C98  value 1.8pF  Package: 0402  Voltage Rating: 50V  [CAP_CER_0402]  (hidden comment: CC0402CRNPO9BN1R8)
C99  value 2.4pF  Package: 0402  Voltage Rating: 50V  [CAP_CER_0402]  (hidden comment: CC0402BRNPO9BN2R4)
D17  SML-D12P8WT86  [LED_SML-D12P8WT86]
D18  DT1140-04LP-7  [TVS_DATA_DT1140-04LP-7]
J11  0878321014  [CON_0878321014]
J12  M20-7810445  [CON_HDR_M20-7810445R]
J13  128-0711-201  [CON_UMC_128-0711-201]
L6  value 2nH  Current Rating: 900 mA  Package: 0402  [FER_0402]  (hidden comment: LQG15HS2N0S02D)
L7  value 2.8nH  Current Rating: 900 mA  Package: 0402  [FER_0402]  (hidden comment: LQG15WZ2N8S02D)
R30  value 150R  Tolerance: 1%  Package: 0402  [RES_0402]  (hidden comment: RC0402FR-07150RL)
R31  value 20k  Tolerance: 1%  Package: 0402  [RES_0402]  (hidden comment: RC0402FR-0720KL)
R32  value 10k  Tolerance: 1%  Package: 0402  [RES_0402]  (hidden comment: RC0402FR-0710KL)
R33  value 6R2  Tolerance: 1%  Package: 0402  [RES_0402]  (hidden comment: RC0402FR-076R2L)
R34  value 499R  Tolerance: 1%  Package: 0402  [RES_0402]  (hidden comment: RC0402FR-07499RL)
R35  value 10k  Tolerance: 1%  Package: 0402  [RES_0402]  (hidden comment: RC0402FR-0710KL)
R36  value 6R2  Tolerance: 1%  Package: 0402  [RES_0402]  (hidden comment: RC0402FR-076R2L)
R37  value 10k  Tolerance: 1%  Package: 0402  [RES_0402]  (hidden comment: RC0402FR-0710KL)
R38  value 1k  Tolerance: 1%  Package: 0402  [RES_0402]  (hidden comment: RC0402FR-071KL)
R39  value 150R  Tolerance: 1%  Package: 0402  [RES_0402]  (hidden comment: RC0402FR-07150RL)
R55  value 0R  Package: 0402  [RES_0402]  (hidden comment: RC0402FR-070RL)
R56  value 0R  Package: 0402  [RES_0402]  (hidden comment: RC0402FR-070RL)
R57  value 0R  Package: 0402  [RES_0402]  (hidden comment: RC0402FR-070RL)
R58  value 0R  Package: 0402  [RES_0402]  (hidden comment: RC0402FR-070RL)
R59  value 0R  Package: 0402  [RES_0402]  (hidden comment: RC0402FR-070RL)
R60  value 0R  Package: 0402  [RES_0402]  (hidden comment: RC0402FR-070RL)
R61  value 0R  Package: 0402  [RES_0402]  (hidden comment: RC0402FR-070RL)
R62  value 0R  Package: 0402  [RES_0402]  (hidden comment: RC0402FR-070RL)
S1  435171014816  [SWI_TACT_435171014816]
U9  ESP32-D0WDQ6-V3  [COM_WIFI_ESP32-D0WDQ6-V3]
U10  MX25L3233FM1I-08Q  [MEM_FLASH_MX25L3233FM1I-08Q]
X1  CM7V-T1A-32KHZ  value 32kHz  [CRY_CM7V-T1A-32.768KHZ-12.5PF-20PPM-TA-QC]
X2  FA-20H 40.0000MF10Z-K3  value 40MHz  [CRY_FA-20H 40.0000MF10Z-K3]

### Blocks framed on the sheet
POWER: C79-C82 L6
LED: D17 R30
Header JTAG: D18 J11
Crystal 32kHz: C85 C86 R33 X1
FLASH: C87 J12 R35 U10
BANK SUPPLIES: C88-C91 C93 C94 R36
Crystal 40MHz: C92 C95 X2
JTAG SELECT: R55-R62
Antenna: C98 C99 J13 L7

### Ports
BOOT_M (in), JTAG_TCK (out), JTAG_TDI (out), JTAG_TDO (out), JTAG_TMS (out), UART_Rx (in), UART_Tx (out), USER_GPIO0 (bidir), USER_GPIO1 (bidir), VSPI_CLK (out), VSPI_CS0 (out), VSPI_D (out), VSPI_Q (in), WIFI_EN (in)

### Nets
3V3: C79.2 C80.2 C81.2 C88.2 C89.2 C90.2 C91.2 C94.2 L6.1 R36.1 R37.2 U9.1(VDDA) U9.19(VDD3P3_RTC) U9.37(VDD3P3_CPU) U9.43(VDDA) U9.46(VDDA)  [also labelled VDD3P3_CPU, VDD3P3_RTC, VDDA_1, VDDA_43_46]
3V3_SDIO: C87.2 C93.2 R35.2 R36.2 U9.26(VDD_SDIO) U10.8(VCC)  [also labelled VDD_SDIO]
3V3_WIFI: C82.2 L6.2 U9.3(VDD3P3) U9.4(VDD3P3)
GND: C79.1 C80.1 C81.1 C82.1 C84.1 C85.1 C86.1 C87.1 C88.1 C89.1 C90.1 C91.1 C92.1 C93.1 C94.1 C95.1 C96.1 C97.1 C98.1 C99.1 D17.K D18.3(VSS) D18.8(VSS) J11.3 J11.5 J11.7 J11.9 J11.10 J12.5 J12.6 J13.2 J13.3 R32.1 R39.1 U9.5(SENSOR_VP) U9.6(SENSOR_CAPP) U9.7(SENSOR_CAPN) U9.8(SENSOR_VN) U9.10(VDET_1) U9.11(VDET_2) U9.49(GND) U10.4(GND) X2.2 X2.4
32K_X_N: C85.2 R33.2 U9.13(32K_XN) X1.1(In/Out)
32K_X_P: C86.2 R33.1 U9.12(32K_XP) X1.2(Out/In)
ANT_OUT: C98.2 J13.1 L7.1
CHIP_PU: C96.2 C97.2 R37.1 S1.4 U9.9(CHIP_PU)
JTAG_TCK: R58.1 U9.20(MTCK)
JTAG_TCK_SW: D18.4(IO3) D18.7(NC) J11.4 R57.2 R58.2
JTAG_TDI: R32.2 R62.1 U9.18(MTDI)
JTAG_TDI_SW: D18.2(IO2) D18.9(NC) J11.8 R61.2 R62.2
JTAG_TDO: R60.1 U9.21(MTDO)
JTAG_TDO_SW: D18.5(IO4) D18.6(NC) J11.6 R59.2 R60.2
JTAG_TMS: R56.1 U9.17(MTMS)
JTAG_TMS_SW: D18.1(IO1) D18.10(NC) J11.2 R55.2 R56.2
LNA_IN: C99.2 L7.2 U9.2(LNA_IN)
SPI_CLK: J12.7 U9.31(SD_CLK) U10.6(SCLK)
SPI_CS0: J12.1 R35.1 U9.30(SD_CMD) U10.1(CS)
SPI_D: J12.8 U9.33(SD_DATA_1) U10.5(SI/SIO0)
SPI_HD: J12.4 U9.28(SD_DATA_2) U10.7(HD/SIO3)
SPI_Q: J12.2 U9.32(SD_DATA_0) U10.2(SO/SIO1)
SPI_WP: J12.3 U9.29(SD_DATA_3) U10.3(WP/SIO2)
USER_LED: R30.2 U9.25(GPIO16)
VSPI_CLK: U9.35(GPIO18) ; port VSPI_CLK
VSPI_CS0: U9.34(GPIO5) ; port VSPI_CS0
VSPI_D: U9.36(GPIO23) ; port VSPI_D
VSPI_Q: U9.38(GPIO19) ; port VSPI_Q
WROOM_Rx: U9.40(U0RXD) ; port UART_Rx
WROOM_TCK: R57.1 ; port JTAG_TCK
WROOM_TDI: R61.1 ; port JTAG_TDI
WROOM_TDO: R59.1 ; port JTAG_TDO
WROOM_TMS: R55.1 ; port JTAG_TMS
WROOM_Tx: R34.2 ; port UART_Tx
XTAL_N: C95.2 U9.44(XTAL_N) X2.1
XTAL_P: C92.2 U9.45(XTAL_P) X2.3
NetC83_1: C83.1 C84.2 R31.1 U9.48(CAP1)
NetC83_2: C83.2 R31.2 U9.47(CAP2)
NetD17_A: D17.A R30.1
NetR34_1: R34.1 U9.41(U0TXD)
NetR38_1: R38.1 S1.3
NetR38_2: R38.2 ; port WIFI_EN
NetR39_2: R39.2 S1.1 S1.2
NetU9_16: U9.16(GPIO27) ; port USER_GPIO1
NetU9_23: U9.23(GPIO0) ; port BOOT_M
NetU9_27: U9.27(GPIO17) ; port USER_GPIO0

Not connected (* = marked no-connect by the designer): J11 1*; U9 14(GPIO25)* 15(GPIO26)* 22(GPIO2)* 24(GPIO4)* 39(GPIO22)* 42(GPIO21)*

### Layout directives
differential pair: 32K_X_N, 32K_X_P, XTAL_N, XTAL_P

### Notes on the sheet
- NOT ACTUAL VALUE: TBD
- SPI vers le Nucleo pour data transfer
- (near X2) Put closest possible to the chip
- As they are bank supplies, the caps must be placed the closest possible to their pin, with the smallest values closer to the pin
- RESET
- Sheet Name
- Project Title
- Global Project
- Size
- Group
- Revision
- Date
- Sheet
- of
- Filename
- Designers
- (in symbol COM_WIFI_ESP32-D0WDQ6-V3) Analog; Wifi; And; Bluetooth; SOC
- (in symbol CON_UMC_128-0711-201) UMC

### Library data of the parts
C79 = CAP_CER_0805YD106KAT2A: CAP - CER 10UF 16V X5R - 0805; Manufacturer #1: AVX Corporation; GRAMS Lib Spec: 2.8; Tolerance: 10%; Magnetic Material: Unknown; Polarized: No; Assembly Type: SMD; CreatedBy/Date: L-P Gauthier / 2018-05-29; Current Rating: *; HelpURL: http://datasheets.avx.com/cx5r.pdf; Manufacturer #2: *; Part Number #1: 0805YD106KAT2A; Part Number #2: *; Power Max: *; Temperature: -55°C ~ 85°C; VerifiedBy: Caroline Paulin - 27 sept 2018; Supplier 1: Digi-Key; Supplier Part Number 1: 478-5165-1-ND; Cryo: UNKNOWN
C80 C90 C93 = CAP_CER_CL05A105KL5NRNC: CAP - CER 1uF 10% 35V X5R - 0402; Manufacturer #1: Samsung Electro-Mechanics; GRAMS Lib Spec: 2.8; Magnetic Material: Unknown; Polarized: NO; Assembly Type: SMD; CreatedBy/Date: Nicolas Roy 2018-10-03; Current Rating: *; HelpURL: http://www.samsungsem.com/kr/support/product-search/mlcc/__icsFiles/afieldfile/2018/06/19/CL05A105KL5NRNC.pdf; Manufacturer #2: *; Part Number #1: CL05A105KL5NRNC; Part Number #2: *; Power Max: *; Temperature: -55°C ~ 85°C; Tolerance: 10%; VerifiedBy: Caroline Paulin - 18 janv 2019; Supplier 1: Digi-Key; Supplier Part Number 1: 1276-6796-1-ND; Cryo: UNKNOWN
C81 C82 C87 C88 C91 C94 C97 = CAP_CER_CL05A104KA5NNNC: CAP - CER 0.1uF 10% 25V X5R - 0402; Manufacturer #1: Samsung Electro-Mechanics; GRAMS Lib Spec: 2.8; Magnetic Material: Unknown; Polarized: NO; Assembly Type: SMD; CreatedBy/Date: Keven Deslandes - 2018/09/26; Current Rating: *; HelpURL: http://www.samsungsem.com/kr/support/product-search/mlcc/CL05A104KA5NNNC.jsp; Manufacturer #2: *; Note: *; Part Number #1: CL05A104KA5NNNC; Part Number #2: *; Power Max: *; Temperature: -55°C ~ 85°C; Tolerance: 10%; VerifiedBy: Nicolas Roy - 2018/12/11; Supplier 1: Digi-Key; Supplier Part Number 1: 1276-1043-1-ND; Cryo: UNKNOWN
C83 = CAP_CER_C0402C332K5RACAUTO: CAP - CER 3.3nF 10% 50V X7R - 0402; Manufacturer #1: KEMET; GRAMS Lib Spec: 2.9; Magnetic Material: Unknown; Polarized: No; Assembly Type: SMD; CreatedBy/Date: Patrick Dufour 2020-05-29; Current Rating: *; HelpURL: https://content.kemet.com/datasheets/KEM_C1023_X7R_AUTO_SMD.pdf; Manufacturer #2: *; Note: *; Part Number #1: C0402C332K5RACAUTO; Part Number #2: *; Power Max: *; Temperature: -55°C ~ 125°C; Tolerance: 10%; VerifiedBy: C.Paulin - 2020-06-24; Supplier 1: Digi-Key; Supplier Part Number 1: 399-15992-2-ND; Cryo: Unknown
C84 = CAP_CER_GRM155R71H103KA88D: CAP - CER 10nF 10% 50V X7R - 0402; Manufacturer #1: Murata Electronics North America; GRAMS Lib Spec: 2.8; Magnetic Material: Unknown; Polarized: No; Assembly Type: SMD; CreatedBy/Date: C.Paulin - 19/06/2019; Current Rating: *; HelpURL: https://search.murata.co.jp/Ceramy/image/img/A01X/G101/ENG/GRM155R71H103KA88-01.pdf; Manufacturer #2: *; Note: *; Part Number #1: GRM155R71H103KA88D; Part Number #2: *; Power Max: *; Temperature: -55°C ~ 125°C; Tolerance: 10%; VerifiedBy: Nicolas V. (2019-07-04); Supplier 1: Digi-Key; Supplier Part Number 1: 490-4516-1-ND; Cryo: UNKNOWN
C85 C86 = CAP_CER_CC0402JRNPO9BN130: CAP - CER 13PF 50V C0G/NP0 - 0402; Manufacturer #1: Yageo; Tolerance: ±5%; GRAMS Lib Spec: 2.8; Magnetic Material: Unknown; Polarized: NO; Current Rating: *; Power Max: *; HelpURL: https://www.yageo.com/upload/media/product/productsearch/datasheet/mlcc/UPY-GP_NP0_16V-to-50V_18.pdf; CreatedBy/Date: Hubert Dube - 04/10/20; VerifiedBy: Louis-Daniel Gaulin - 09/11/2020; Temperature: -55°C ~ 125°C; Manufacturer #2: *; Assembly Type: SMD; Part Number #2: *; Part Number #1: CC0402JRNPO9BN130; Cryo: UNKNOWN; Supplier 1: Digi-Key; Supplier Part Number 1: 311-3754-1-ND
C89 = CAP_CER_CC0402JRNPO9BN101: as C32 on sheet HIVE_SIGHT_DECAWAVE_A; Assembly Type: SMD; CreatedBy/Date: Philippe Arsenault/ 2020-07-24; Current Rating: *; HelpURL: https://www.yageo.com/upload/media/product/productsearch/datasheet/mlcc/UPY-GPHC_X7R_6.3V-to-50V_18.pdf; Manufacturer #2: *; Note: *; Part Number #1: CC0402JRNPO9BN101; Part Number #2: *; Power Max: *; Temperature: -55°C ~ 125°C; Tolerance: ±5%; VerifiedBy: Louis-Daniel Gaulin / 2020-07-29; Cryo: UNKNOWN; Supplier 1: Digi-Key; Supplier Part Number 1: 311-1024-1-ND
C92 C95 = CAP_CER_CC0402DRNPO9BN8R0: CAP - CER 8PF 50V C0G/NP0 - 0402; Manufacturer #1: Yageo; Tolerance: ±0.5pF; GRAMS Lib Spec: 2.8; Magnetic Material: Unknown; Polarized: NO; Current Rating: *; Power Max: *; HelpURL: https://www.yageo.com/upload/media/product/productsearch/datasheet/mlcc/UPY-GP_NP0_16V-to-50V_18.pdf; CreatedBy/Date: Hubert Dube - 04/10/20; VerifiedBy: Louis-Daniel Gaulin - 09/11/2020; Temperature: -55°C ~ 125°C; Manufacturer #2: *; Assembly Type: SMD; Part Number #2: *; Part Number #1: CC0402DRNPO9BN8R0; Cryo: UNKNOWN; Supplier 1: Digi-Key; Supplier Part Number 1: 311-1639-1-ND
C96 = CAP_CER_CL05A105MP5NNNC: CAP - CER 1uF 20% 10V X5R - 0402; Manufacturer #1: Samsung Electro-Mechanics; GRAMS Lib Spec: 2.8; Magnetic Material: YES; Polarized: NO; Cryo: UNKNOWN; Assembly Type: SMD; CreatedBy/Date: Jonathan Bouchard 2018-07-05; Current Rating: *; HelpURL: http://www.samsungsem.com/kr/support/product-search/mlcc/__icsFiles/afieldfile/2018/06/19/CL05A105MP5NNNC.pdf; Manufacturer #2: *; Note: *; Part Number #1: CL05A105MP5NNNC; Part Number #2: *; Power Max: *; Temperature: -55°C ~ 85°C; Tolerance: 20%; VerifiedBy: Arnaud Samson 16-07-18; Supplier 1: Digi-Key; Supplier Part Number 1: 1276-1448-1-ND
C98 = CAP_CER_CC0402CRNPO9BN1R8: CAP - CER 1.8PF 50V C0G/NP0 - 0402; Manufacturer #1: Yageo; Tolerance: ±0.25pF; GRAMS Lib Spec: 2.8; Magnetic Material: Unknown; Polarized: NO; Current Rating: *; Power Max: *; HelpURL: https://www.yageo.com/upload/media/product/productsearch/datasheet/mlcc/UPY-GP_NP0_16V-to-50V_18.pdf; CreatedBy/Date: Hubert Dube - 04/10/20; VerifiedBy: Louis-Daniel Gaulin - 09/11/2020; Temperature: -55°C ~ 125°C; Manufacturer #2: *; Assembly Type: SMD; Part Number #2: *; Part Number #1: CC0402CRNPO9BN1R8; Cryo: UNKNOWN; Supplier 1: Digi-Key; Supplier Part Number 1: 311-1004-1-ND
C99 = CAP_CER_CC0402BRNPO9BN2R4: CAP - CER 2.4PF 50V C0G/NP0 - 0402; Manufacturer #1: Yageo; Tolerance: ±0.1pF; GRAMS Lib Spec: 2.8; Magnetic Material: Unknown; Polarized: NO; Current Rating: *; Power Max: *; HelpURL: https://www.yageo.com/upload/media/product/productsearch/datasheet/mlcc/UPY-GP_NP0_16V-to-50V_18.pdf; CreatedBy/Date: Hubert Dube - 04/10/20; VerifiedBy: Louis-Daniel Gaulin - 09/11/2020; Temperature: -55°C ~ 125°C; Manufacturer #2: *; Assembly Type: SMD; Part Number #2: *; Part Number #1: CC0402BRNPO9BN2R4; Cryo: UNKNOWN; Supplier 1: Digi-Key; Supplier Part Number 1: 311-3703-1-ND
D17 = LED_SML-D12P8WT86: as D6 on sheet HIVE_SIGHT_DECAWAVE_A; Manufacturer #2: *; Power Max: *; Part Number #1: SML-D12P8WT86; Part Number #2: *; HelpURL: https://d1d2qsbl8m0m72.cloudfront.net/en/products/databook/datasheet/opto/led/chip_mono/sml-d12x8_d13x8-e.pdf; Supplier 1: Digi-Key; Supplier Part Number 1: 511-1579-2-ND; Assembly Type: SMD; Temperature: -40 ~ 85 °C; Package: 0603; CreatedBy/Date: Keven Deslandes - 2018/11/21; Tolerance: *; VerifiedBy: Caroline Paulin - 13 février 2019; Cryo: UNKNOWN
D18 = TVS_DATA_DT1140-04LP-7: TVS - DIODE 5.5V 10V - 10-UFDFN; Manufacturer #1: Diodes Incorporated; Value: 5.5V @ 1mA (Reverse Standoff); Voltage Rating: 6V (Breakdown); Current Rating: 6A (8/20µs); Power Max: 60W (8/20µs); GRAMS Lib Spec: 2.8; Note: Fooprint created from tpd4e05u06 (TI) for manufacturability (soldermask); Magnetic Material: Unknown; Polarized: Yes; Tolerance: -; HelpURL: https://www.diodes.com/assets/Datasheets/DT1140-04LP.pdf; CreatedBy/Date: Joël Lemay 2019-11-20; VerifiedBy: C.Paulin - 21/11/2019; Temperature: -55°C~85°C; Package: 10-UFDFN; Manufacturer #2: -; Assembly Type: SMD; Part Number #2: -; Part Number #1: DT1140-04LP-7; Supplier 1: Digi-Key; Supplier Part Number 1: DT1140-04LP-7DICT-ND; Cryo: UNKNOWN
J11 = CON_0878321014: CON - HEADER SMD 10POS 2mm - SMD; Manufacturer #1: Molex; GRAMS Lib Spec: 2.8; Magnetic Material: Unknown; Polarized: YES; Value: *; Tolerance: *; Voltage Rating: *; Current Rating: *; Power Max: *; HelpURL: https://www.molex.com/webdocs/datasheets/pdf/en-us/0878321014_PCB_HEADERS.pdf; CreatedBy/Date: Hubert Dube - 8/10/2020; VerifiedBy: Louis-Daniel Gaulin / 12-11-2020; Temperature: -55°C ~ 105 °C; Package: SMD; Manufacturer #2: *; Assembly Type: SMD; Part Number #2: *; Part Number #1: 0878321014; Cryo: UNKNOWN; Supplier 1: Digi-Key; Supplier Part Number 1: WM14376CT-ND
J12 = CON_HDR_M20-7810445: CONN RCPT 8POS 0.1 GOLD SMD; Manufacturer #1: Harwin Inc.; GRAMS Lib Spec: 2.8; Magnetic Material: Unknown; Polarized: NO; Value: *; Tolerance: *; Voltage Rating: *; Current Rating: *; Power Max: *; HelpURL: https://cdn.harwin.com/pdfs/M20-781.pdf; CreatedBy/Date: Hubert Dube - 31/10/2020; VerifiedBy: Louis-Daniel Gaulin - 09/11/2020; Temperature: -40°C ~ 105°C; Package: SMD; Manufacturer #2: *; Assembly Type: SMD; Part Number #2: *; Part Number #1: M20-7810445; Cryo: UNKNOWN; Supplier 1: Digi-Key; Supplier Part Number 1: 952-3209-ND
J13 = CON_UMC_128-0711-201: as J7 on sheet HIVE_SIGHT_DECAWAVE_A; Current Rating: *; Manufacturer #2: *; Power Max: *; Part Number #1: 128-0711-201; Part Number #2: *; HelpURL: https://belfuse.com/resources/cinch-brochures/CCS%20Johnson%20UMC%20Ultra%20Miniature%20Connectors.pdf; Supplier 1: Digi-Key; Supplier Part Number 1: J983CT-ND; Assembly Type: SMD; Magnetic Material: *; Temperature: -40°C ~ 90°C; Package: SMD; CreatedBy/Date: Keven Desandes - 2018/09/27; Tolerance: *; VerifiedBy: Caroline Paulin - 23 janv 2019
L6 = IND_LQG15HS2N0S02D: IND - 2nH 900mA 100mOhm  - 0402; Manufacturer #1: Murata Electronics; Tolerance: 0.3nH; GRAMS Lib Spec: 2.8; Magnetic Material: Unknown; Polarized: NO; Voltage Rating: *; Power Max: *; HelpURL: https://search.murata.co.jp/Ceramy/image/img/P02/JELF243B-0010.pdf; CreatedBy/Date: Hubert Dube  - 21/07/20; VerifiedBy: Louis-Daniel Gaulin - 09/11/2020; Temperature: -55°C ~ 125°C; Manufacturer #2: *; Assembly Type: SMD; Part Number #2: *; Part Number #1: LQG15HS2N0S02D; Cryo: UNKNOWN; Supplier 1: Digi-Key; Supplier Part Number 1: 490-6569-1-ND
L7 = IND_LQG15WZ2N8S02D: IND - 2.8nH 900mA 80mOhm  - 0402; Manufacturer #1: Murata Electronics; Tolerance: 0.3nH; GRAMS Lib Spec: 2.8; Magnetic Material: Unknown; Polarized: NO; Voltage Rating: *; Power Max: *; HelpURL: https://search.murata.co.jp/Ceramy/image/img/P02/JELF243B-9117.pdf; CreatedBy/Date: Hubert Dube  - 3/10/20; VerifiedBy: Louis-Daniel Gaulin - 09/11/2020; Temperature: -55°C ~ 125°C; Manufacturer #2: *; Assembly Type: SMD; Part Number #2: *; Part Number #1: LQG15WZ2N8S02D; Cryo: UNKNOWN; Supplier 1: Digi-Key; Supplier Part Number 1: 490-LQG15WZ2N8S02DCT-ND
R30 R39 = RES_RC0402FR-07150RL: as R8 on sheet HIVE_SIGHT_DECAWAVE_A; Assembly Type: SMD; CreatedBy/Date: Jonathan Bouchard 2019-03-25; Current Rating: *; HelpURL: http://www.yageo.com/documents/recent/PYu-RC_Group_51_RoHS_L_10.pdf; Manufacturer #2: *; Part Number #1: RC0402FR-07150RL; Part Number #2: *; Power Max: 1/16W; Temperature: -55°C ~ 155°C; VerifiedBy: Nicolas V. (2019-05-02); Supplier 1: Digi-Key; Supplier Part Number 1: 311-150LRCT-ND; Cryo: UNKNOWN
R31 = RES_RC0402FR-0720KL: RES - 20K 1% 1/16W  - 0402; Manufacturer #1: Yageo; GRAMS Lib Spec: 2.8; Magnetic Material: Unknown; Polarized: No; Voltage Rating: 50V; Assembly Type: SMD; CreatedBy/Date: Keven Deslandes 2018-10-18; Current Rating: *; HelpURL: http://www.yageo.com/documents/recent/PYu-RC_Group_51_RoHS_L_10.pdf; Manufacturer #2: *; Note: *; Part Number #1: RC0402FR-0720KL; Part Number #2: *; Power Max: 1/16W; Temperature: -55°C ~ 155°C; VerifiedBy: Caroline Paulin - 7 janv 2019; Supplier 1: Digi-Key; Supplier Part Number 1: 311-20.0KLRCT-ND; Cryo: UNKNOWN
R32 R35 R37 = RES_RC0402FR-0710KL: RES - 10K OHMS 1% 1/16W - 0402; Manufacturer #1: Yageo; GRAMS Lib Spec: 2.8; Magnetic Material: UNKNOWN; Polarized: NO; Voltage Rating: 50V; Assembly Type: SMD; CreatedBy/Date: Nicolas V. (2018-11-20); Current Rating: *; HelpURL: http://www.yageo.com/documents/recent/PYu-RC_Group_51_RoHS_L_9.pdf; Manufacturer #2: *; Note: *; Part Number #1: RC0402FR-0710KL; Part Number #2: *; Power Max: 1/16W; Temperature: -55°C ~ 155°C; VerifiedBy: Nicolas V. (2018-11-20); Supplier 1: Digi-Key; Supplier Part Number 1: 311-10.0KLRCT-ND; Cryo: UNKNOWN
R33 R36 = RES_RC0402FR-076R2L: RES - 6.2R 1% 1/16W - 0402; Manufacturer #1: Yageo; Part Number #1: RC0402JR-076R2L; GRAMS Lib Spec: 2.8c; Magnetic Material: Unknown; Polarized: No; Voltage Rating: 50V; Assembly Type: SMD; CreatedBy/Date: Hubert Dubé 04/10/2020; Current Rating: *; HelpURL: https://www.yageo.com/upload/media/product/productsearch/datasheet/rchip/PYu-RC_Group_51_RoHS_L_11.pdf; Manufacturer #2: *; Note: *; Part Number #2: *; Power Max: 1/16W; Temperature: -55°C ~ 155°C; VerifiedBy: Louis-Daniel Gaulin - 09/11/2020; Supplier 1: Digi-Key; Supplier Part Number 1: 13-RC0402FR-076R2LCT-ND
R34 = RES_RC0402FR-07499RL: RES - 499 OHM 1% 1/16W - 0402; Manufacturer #1: Yageo; GRAMS Lib Spec: 2.8; Magnetic Material: Unknown; Polarized: NO; Voltage Rating: 50V; Assembly Type: SMD; CreatedBy/Date: Nicolas Roy/05 dec. 2018; Current Rating: *; HelpURL: http://www.yageo.com/documents/recent/PYu-RC_Group_51_RoHS_L_10.pdf; Manufacturer #2: *; Note: *; Part Number #1: RC0402FR-07499RL; Part Number #2: *; Power Max: 1/16W; Temperature: -55°C ~ 155°C; VerifiedBy: Charles Richard 14-01-2019; Supplier 1: Digi-Key; Supplier Part Number 1: 311-499LRCT-ND; Cryo: UNKNOWN
R38 = RES_RC0402FR-071KL: RES - 1K OHM 1% 1/16W - 0402; Manufacturer #1: Yageo; GRAMS Lib Spec: 2.8; Magnetic Material: YES; Polarized: NO; Voltage Rating: 50V; Cryo: UNKNOWN; Assembly Type: SMD; CreatedBy/Date: Jonathan Bouchard 2018-07-05; Current Rating: *; HelpURL: http://www.yageo.com/documents/recent/PYu-RC_Group_51_RoHS_L_9.pdf; Manufacturer #2: *; Note: *; Part Number #1: RC0402FR-071KL; Part Number #2: *; Power Max: 1/16W; Temperature: -55°C ~ 155°C; VerifiedBy: Arnaud Samson 16-07-18; Supplier 1: Digi-Key; Supplier Part Number 1: 311-1.00KLRCT-ND
R55-R62 = RES_RC0402FR-070RL: RES - 0R 1/16W 1A  - 0402; Manufacturer #1: Yageo; GRAMS Lib Spec: 2.8; Magnetic Material: Unknown; Polarized: No; Voltage Rating: 50V; Assembly Type: SMD; CreatedBy/Date: Keven Deslandes 2018-09-12; Current Rating: 1A; HelpURL: http://www.yageo.com/documents/recent/PYu-RC_Group_51_RoHS_L_10.pdf; Manufacturer #2: *; Note: *; Part Number #1: RC0402FR-070RL; Part Number #2: *; Power Max: 1/16W; Temperature: -55°C ~ 155°C; VerifiedBy: Caroline Paulin - 27 fév 2019; Supplier 1: Digi-Key; Supplier Part Number 1: 311-0.0LRCT-ND; Cryo: UNKNOWN
S1 = SWI_TACT_435171014816: SWI - SWITCH TACTILE SPST-NO 0.05A 12V -SMD; Manufacturer #1: Würth Elektronik; Current Rating: 50mA; Voltage rating: 12VDC; Polarized: No; Magnetic Material: UNKNOWN; GRAMS Lib Spec: 2.8; Manufacturer #2: *; Power Max: *; Value: SPST-NO; Part Number #1: 435171014816; Part Number #2: *; HelpURL: https://www.we-online.com/catalog/datasheet/435171014816.pdf; Supplier 1: Digi-Key; Supplier Part Number 1: 732-435171014816CT-ND; Assembly Type: SMD; Temperature: -40°C ~ 85°C; Package: SMD; CreatedBy/Date: Hubert Dube - 22/07/20; Tolerance: *; VerifiedBy: Louis-Daniel Gaulin / 12-11-2020; Cryo: UNKNOWN
U9 = COM_WIFI_ESP32-D0WDQ6-V3: COM_WIFI - IC RF TxRx + MCU, WiFi 802.11b/g/n, Bluetooth 4.2 2.4GHz - 48-VFQFN Exposed Pad; Manufacturer #1: Espressif Systems; Voltage Rating: 2.3-3.63; Current Rating: Rx 100mA/Tx 240mA; Power Max: 900mW; GRAMS Lib Spec: 2.8; Magnetic Material: Unknown; Polarized: Yes; Cryo: No; Value: *; Tolerance: *; HelpURL: https://www.espressif.com/sites/default/files/documentation/esp32_datasheet_en.pdf; CreatedBy/Date: Louis-Daniel Gaulin / 10-12-2020; VerifiedBy: Hubert Dube - 14/12/2020; Temperature: -40°C ~ 125°C; Package: 48-VFQFN 6x6; Manufacturer #2: *; Note: *; Assembly Type: SMD; Part Number #2: *; Part Number #1: ESP32-D0WDQ6-V3; Supplier 1: Digi-Key; Supplier Part Number 1: 1904-ESP32-D0WDQ6-V3CT-ND
U10 = MEM_FLASH_MX25L3233FM1I-08Q: MEM - EFLASH 32Mb SPI 133MHZ - 8-SOIC; Manufacturer #1: Macronix; Value: 32Mb (8M x 4); Voltage Rating: 2.65V ~ 3.6V; GRAMS Lib Spec: 2.8; Magnetic Material: UNKNOWN; Polarized: YES; Tolerance: *; Current Rating: *; Power Max: *; HelpURL: https://www.macronix.com/Lists/Datasheet/Attachments/7426/MX25L3233F,%203V,%2032Mb,%20v1.6.pdf; CreatedBy/Date: Hubert Dube - 22/07/01; Temperature: -40°C ~ 85°C; Package: 8-WSON; Manufacturer #2: *; Note: *; Assembly Type: SMD; Part Number #2: *; Part Number #1: MX25L3233FM1I-08Q; Cryo: UNKNOWN; Supplier 1: Digi-Key; Supplier Part Number 1: 1092-1221-ND
X1 = CRY_CM7V-T1A-32.768KHZ-12.5PF-20PPM-TA-QC: CRY - 32.768KHZ tol:20ppm 12.5PF - 2-SMD; Manufacturer #1: Micro Crystal AG; Magnetic Material: Unknown; Polarized: No; GRAMS Lib Spec: 2.8; Tolerance: ±20ppm; Assembly Note: DNI; Assembly Type: SMD; Current Rating: *; Manufacturer #2: *; Note: *; Part Number #1: CM7V-T1A-32.768KHZ-12.5PF-20PPM-TA-QC; Part Number #2: *; Package: 2-SMD, No Lead; Power Max: *; Voltage rating: *; Temperature: -40°C ~ 85°C; HelpURL: https://www.microcrystal.com/fileadmin/Media/Products/32kHz/Datasheet/CM7V-T1A.pdf; CreatedBy/Date: Hubert Dube - 21/07/20; VerifiedBy: Louis-Daniel Gaulin - 09/11/2020; Cryo: UNKNOWN; Supplier 1: Digi-Key; Supplier Part Number 1: 2195-CM7V-T1A-32.768KHZ-12.5PF-20PPM-TA-QCCT-ND
X2 = CRY_FA-20H 40.0000MF10Z-K3: CRY - 40MKHZ 10ppm 10PF - 4-SMD; Manufacturer #1: EPSON; Magnetic Material: Unknown; Polarized: No; GRAMS Lib Spec: 2.8; Assembly Type: SMD; Current Rating: *; Manufacturer #2: *; Note: *; Part Number #1: FA-20H 40.0000MF10Z-K3; Part Number #2: *; Package: 4 - SMD, No Lead; Power Max: *; Voltage rating: *; Temperature: -20°C ~ 75°C; HelpURL: https://support.epson.biz/td/api/doc_check.php?dl=brief_FA-20H&lang=en; CreatedBy/Date: Hubert Dube - 21/07/20; Tolerance: ±10ppm; VerifiedBy: Louis-Daniel Gaulin - 09/11/2020; Cryo: UNKNOWN; Supplier 1: Digi-Key; Supplier Part Number 1: SER4045CT-ND